# Altium schematic sheet M4-Comprator.SchDoc
size A4; ApprovedBy: -; CheckedBy: h.t.t.monfared; Author: h.t.t.monfared; Revision: 1.00; SheetNumber: 4; SheetTotal: 10; Project Code:: UFM Sensor Controller; Document Title:: Comperator Sheet
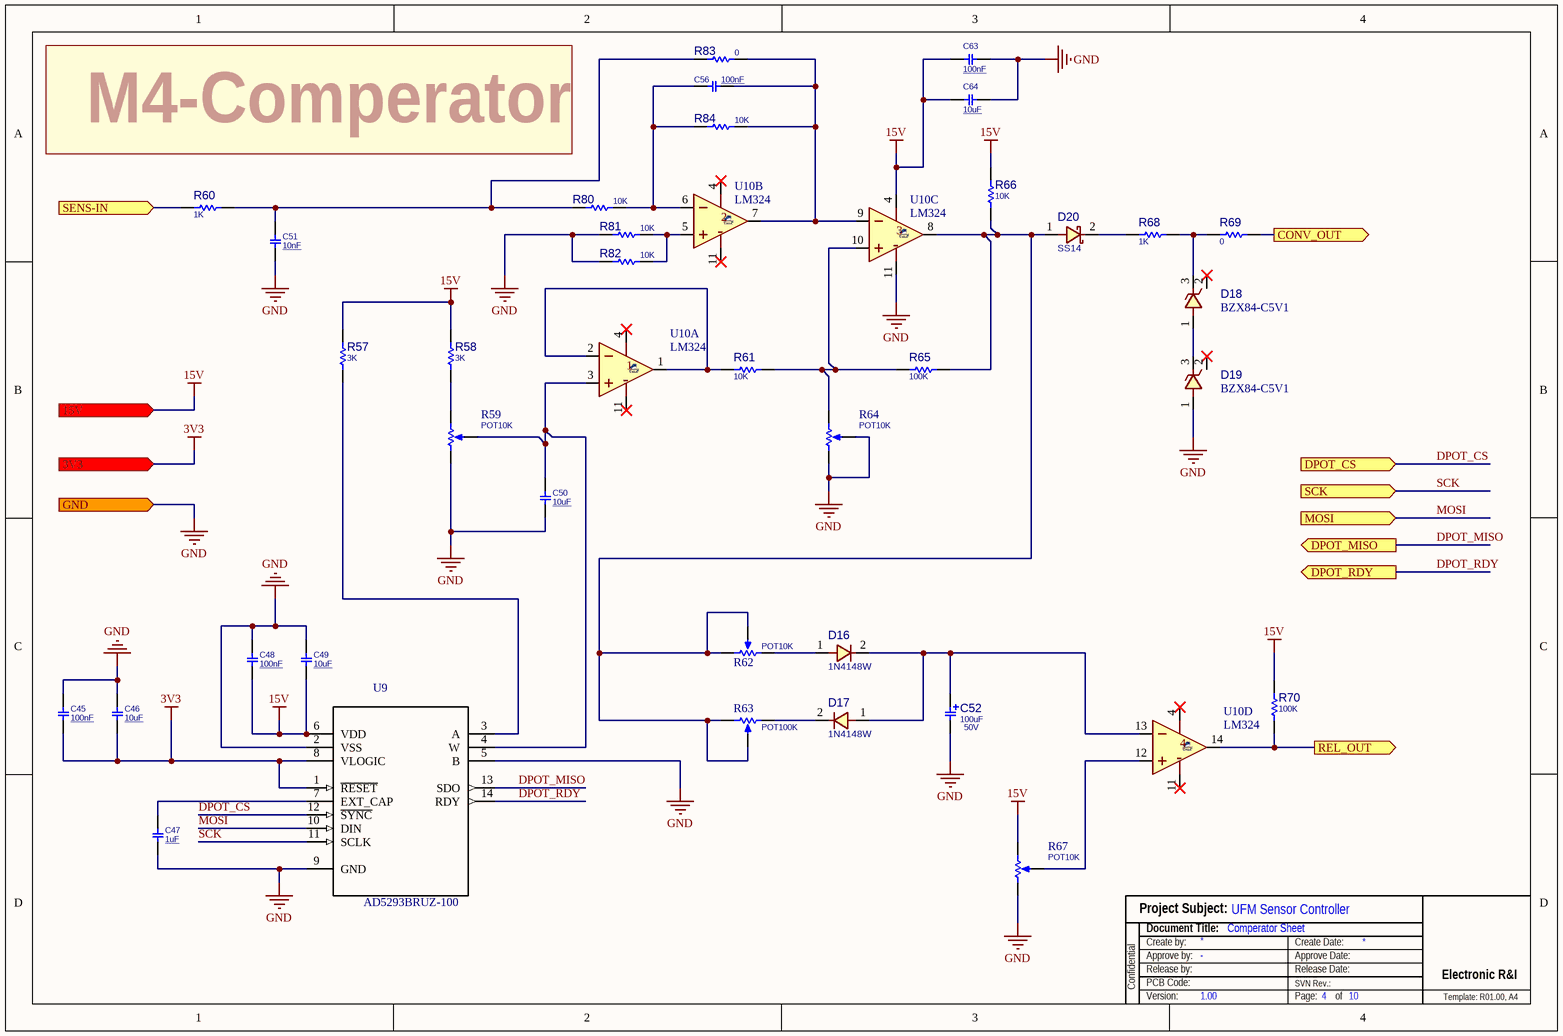
[diagram p0: M4-Comprator.SchDoc]

## Parts
C45  100nF  [C1206]
C46  10uF  [C1206]
C47  1uF  [C1206]
C48  100nF  [C1206]
C49  10uF  [C1206]
C50  10uF  [C1206]
C51  10nF  [C1206]
C52  PARAM2: 50V  [C_EL_8]  (hidden comment: 100uF)
C56  100nF  [C1206]
C63  100nF  [C1206]
C64  10uF  [C1206]
D16  1N4148W  [D_SOD123W]
D17  1N4148W  [D_SOD123W]
D18  MANF_P#: BZX84-C5V1  [SOT23_3]  (hidden comment: ZENER2V4)
D19  MANF_P#: BZX84-C5V1  [SOT23_3]  (hidden comment: ZENER2V4)
D20  SS14  [D_SMB]
R57  3K  [R1206]
R58  3K  [R1206]
R59  POT10K  [POT_3296W]
R60  1K  [R1206]
R61  10K  [R1206]
R62  POT10K  [POT_3296W]
R63  POT100K  [POT_3296W]
R64  POT10K  [POT_3296W]
R65  100K  [R1206]
R66  10K  [R1206]
R67  POT10K  [POT_3296W]
R68  1K  [R1206]
R69  0  [R1206]
R70  100K  [R1206]
R80  10K  [R1206]
R81  10K  [R1206]
R82  10K  [R1206]
R83  0  [R1206]
R84  10K  [R1206]
U9  AD5293BRUZ-100  [RU_14_ADI]
U10  LM324  [SO_14]  (parts A,B,C,D of 4)

## Ports
3V3 (in), 15V (in), CONV_OUT (out), DPOT_CS (in), DPOT_MISO (out), DPOT_RDY (out), GND (in), MOSI (in), REL_OUT (out), SCK (in), SENS-IN (in)

## Nets
3V3: C45.1 C46.1 U9.1(~{RESET}) U9.8(VLOGIC) ; port 3V3
15V: C48.1 C49.1 C63.1 C64.1 R57.2 R58.2 R66.2 R67.3(BOT) R70.2 U9.6(VDD) U10.4(V+) ; port 15V
GND: C45.2 C46.2 C47.1 C48.2 C49.2 C50.1 C51.1 C52.2 C63.2 C64.2 D19.1 R59.1(TOP) R64.1(TOP) R64.2(TAP) R67.1(TOP) R81.1 R82.1 U9.2(VSS) U9.5(B) U9.9(GND) U10.11(V-) ; port GND
CONV_OUT: R69.2 ; port CONV_OUT
DPOT_CS: U9.12(~{SYNC}) ; port DPOT_CS
DPOT_MISO: U9.13(SDO) ; port DPOT_MISO
DPOT_RDY: U9.14(RDY) ; port DPOT_RDY
MOSI: U9.10(DIN) ; port MOSI
REL_OUT: R70.1 U10.14(OUT) ; port REL_OUT
SCK: U9.11(SCLK) ; port SCK
SENS-IN: R60.1 ; port SENS-IN
NetC47_2: C47.2 U9.7(EXT_CAP)
NetC50_2: C50.2 R59.2(TAP) U9.4(W) U10.3(IN+)
NetC51_2: C51.2 R60.2 R80.1 R83.1
NetC52_1: C52.1 D16.2 D17.1 U10.13(IN-)
NetC56_1: C56.1 R80.2 R84.1 U10.6(IN-)
NetC56_2: C56.2 R83.2 R84.2 U10.7(OUT) U10.9(IN-)
NetD16_1: D16.1 R62.1(TOP)
NetD17_2: D17.2 R63.3(BOT)
NetD18_1: D18.1 D19.3
NetD18_3: D18.3 R68.2 R69.1
NetD20_1: D20.1 R62.2(TAP) R62.3(BOT) R63.1(TOP) R63.2(TAP) R65.2 R66.1 U10.8(OUT)
NetD20_2: D20.2 R68.1
NetR57_1: R57.1 U9.3(A)
NetR58_1: R58.1 R59.3(BOT)
NetR61_1: R61.1 U10.1(OUT) U10.2(IN-)
NetR61_2: R61.2 R64.3(BOT) R65.1 U10.10(IN+)
NetR67_2: R67.2(TAP) U10.12(IN+)
NetR81_2: R81.2 R82.2 U10.5(IN+)

Not connected (* = marked no-connect by the designer): D18 2*; D19 2*

## Notes on the sheet
- M4-Comperator
- Project Subject:
- Confidential
- Release by:
- Document Title:
- Create by:
- PCB Code:
- Approve by:
- SVN Rev.:
- Create Date:
- Release Date:
- Approve Date:
- Electronic R&I
- Version:
- Page:
- of
- Template: R01.00, A4

## Library data of the parts
C45-C51 C56 C63 C64 = CAP_SMD_MLCC: CAP, MLCC, 1nF, 50V, C0G, 10%, 0402; MANF_P#: MANF_PART#; MANF: Murata; PARAM: C0G, 10%; PRICE: 100= 1$; DESC: CAP, MLCC, 1nF, 50V, C0G, 10%, 0402; PARAM2: 50V; ASSEMBLY: ASSEMBLY
  C45 C48 C56 C63: VALUE: 100nF
  C46 C49 C50 C64: VALUE: 10uF
  C47: VALUE: 1uF
  C51: VALUE: 10nF
C52 = CAP_SMD_EL: CAP, THD, ELEC,; MANF_P#: MANF_PART#; DESC: DESCRIPTION; DIST#: MOUSER; PARAM: 20%; PRICE: 10= -$; MANF: MANF; ASSEMBLY: ASSEMBLY; VALUE: 100uF
D16 D17 = DIODE_SMD_1N4148_SOD80: DIODE, FAST SWTICHING, 0.3A, 0.5W; DESC: DESCRIPTION; PARAM: 75V; PARAM2: 300mA, 0.5W; MANF_P#: 1N4148; MANF: MANF; ASSEMBLY: ASSEMBLY; PRICE: PRICE; VALUE: 1N4148W
D18 D19 = DIODE_SMD_ZENER_BZX84-C2V4: DIODE, ZENER, 0.25W, 2.4V; MANF: NXP; DESC: DESCRIPTION; PARAM2: 5.1V, 0.9VF; PARAM: 0.25W, 10mA IF; ASSEMBLY: ASSEMBLY; PRICE: PRICE; VALUE: ZENER2V4
D20 = DIODE_SMD_SCHOTTKY_SS14: DIODE, SCHOTTKY, 40V, 1A; MANF: Vishay; DESC: DESCRIPTION; MANF_P#: SS14-E3; ASSEMBLY: ASSEMBLY; PRICE: PRICE; PARAM2: 1A; PARAM: 40V; VALUE: SS14
R57 R58 R60 R61 R65 R66 R68-R70 R80-R84 = RES_SMD: RESISTOR, SMD; PARAM: -W; DESC: DESCRIPTION; DIST#: MOUSER; PARAM2: 1%; MANF_P#: -; MANF: -; ASSEMBLY: ASSEMBLY; PRICE: 100= 0.5$
  R57 R58: VALUE: 3K
  R60 R68: VALUE: 1K
  R61 R66 R80-R82 R84: VALUE: 10K
  R65 R70: VALUE: 100K
  R69 R83: VALUE: 0
R59 R62-R64 R67 = RES_THD_POT_3296W: RESISTOR, THD, Potentiometer
  R59 R62 R64 R67: VALUE: POT10K
  R63: VALUE: POT100K
U9 = AD5293BRUZ-100: Digital Potentiometer 100k Ohm 1 Circuit 1024 Taps SPI Interface 14-TSSOP; MF: Analog Devices; Price: None; Availability: Unavailable; SnapEDA_Link: https://www.snapeda.com/parts/AD5293BRUZ-100/Analog%20Devices%20Inc./view-part/385281/?ref=snap; Package: TSSOP-14 Analog Devices; MP: AD5293BRUZ-100; Value: *
U10 = LM324_SOP14: AMP, Quad, Single-Supply; MANF: ON, Texas Instruments, ST; MANF_P#: LM324AD; VALUE: LM324